# EAGLE design M1501X (EAGLE 6.6.0)
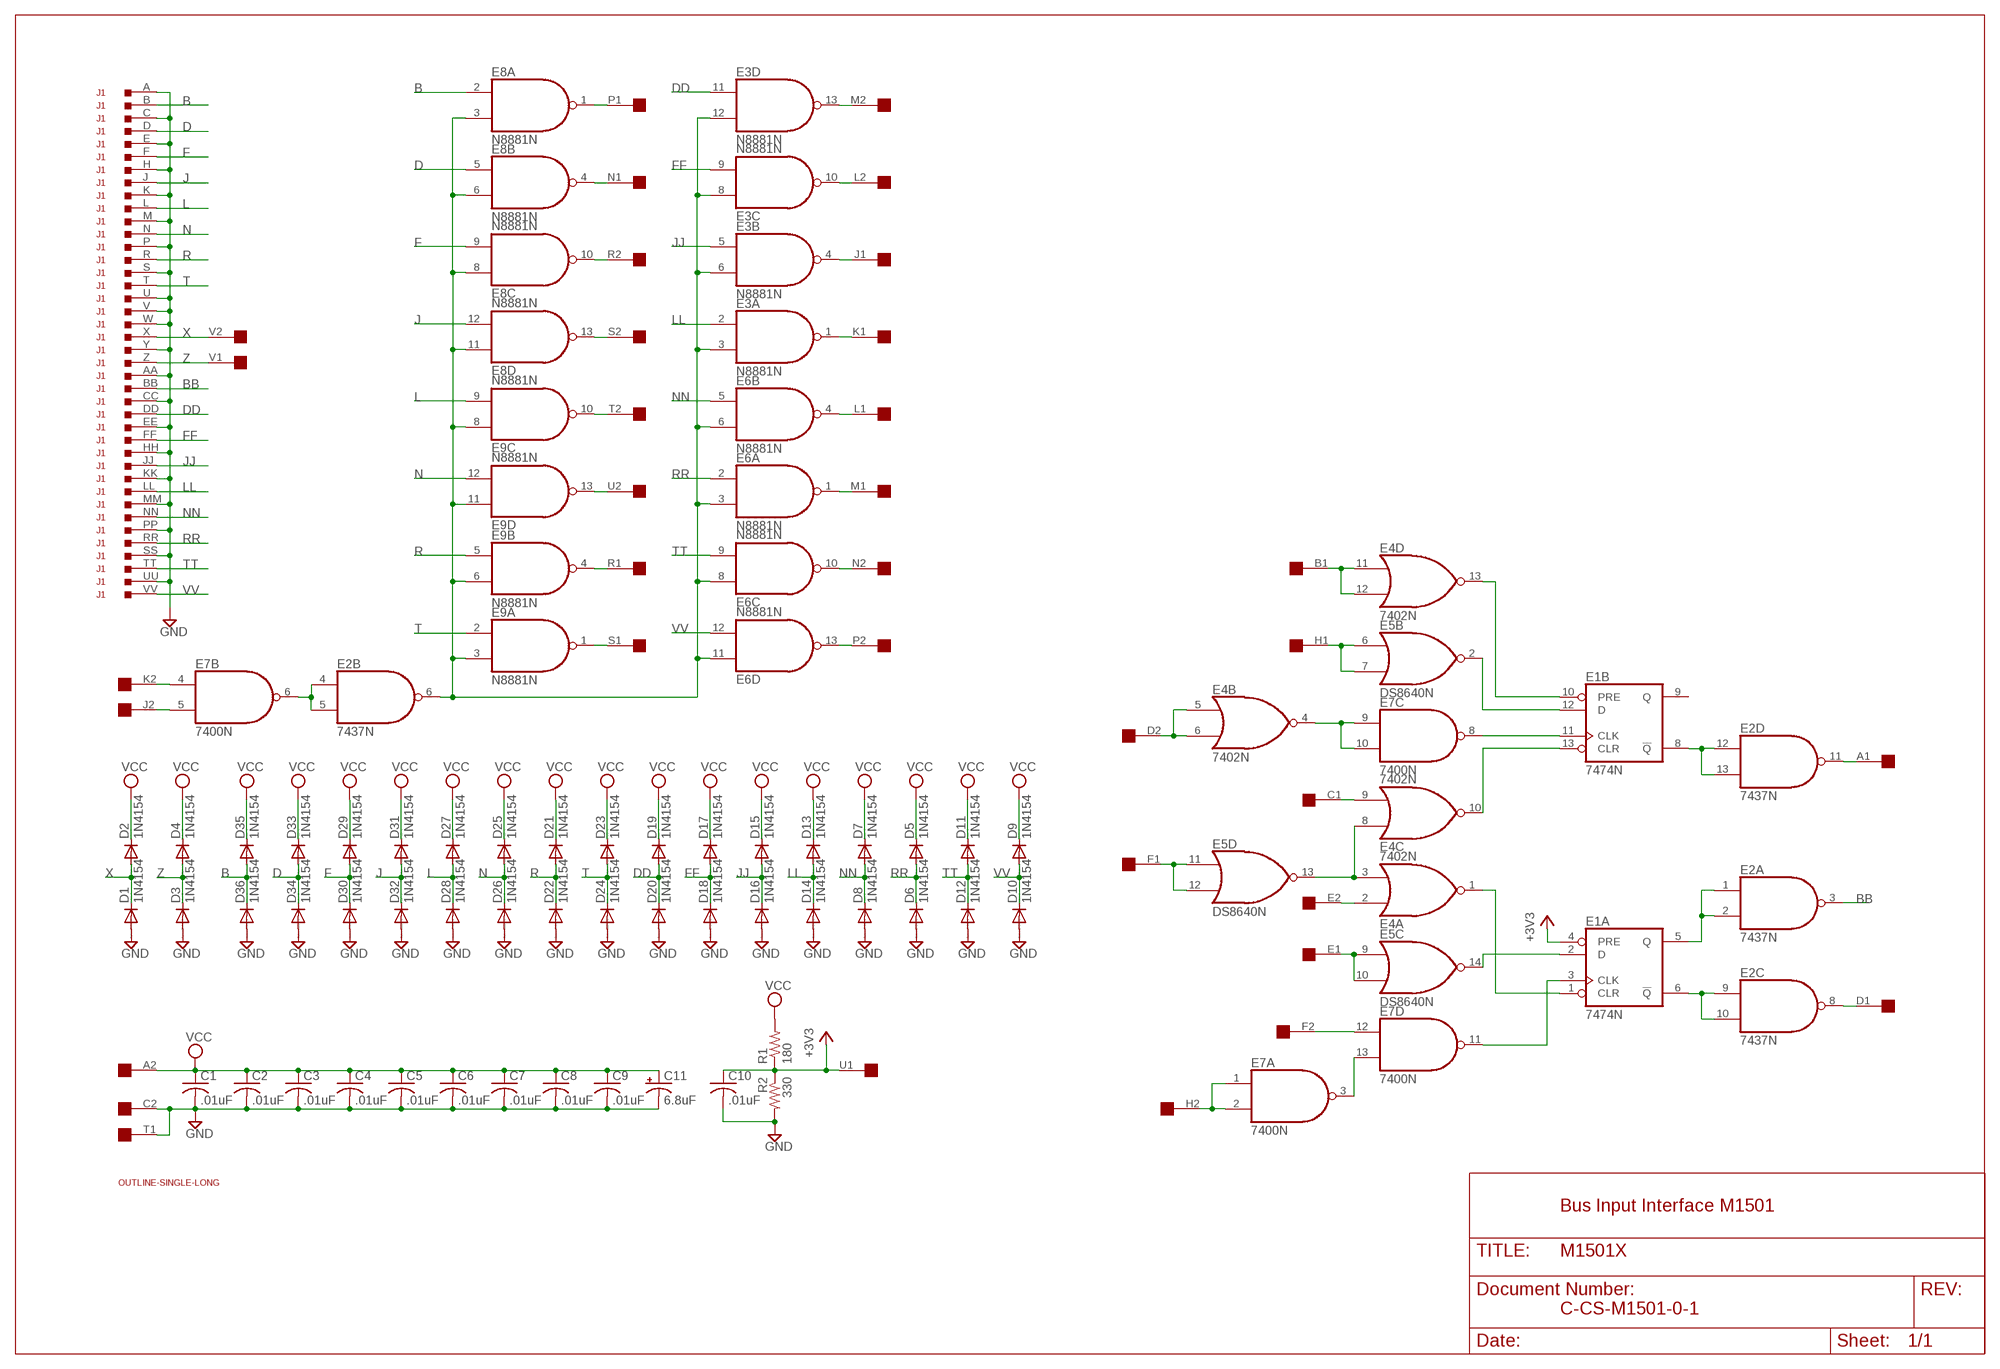
[diagram p0: schematic, sheet 1]

## Parts
C1  .01uF  C-US050-025X075  [C050-025X075]
C2  .01uF  C-US050-025X075  [C050-025X075]
C3  .01uF  C-US050-025X075  [C050-025X075]
C4  .01uF  C-US050-025X075  [C050-025X075]
C5  .01uF  C-US050-025X075  [C050-025X075]
C6  .01uF  C-US050-025X075  [C050-025X075]
C7  .01uF  C-US050-025X075  [C050-025X075]
C8  .01uF  C-US050-025X075  [C050-025X075]
C9  .01uF  C-US050-025X075  [C050-025X075]
C10  .01uF  C-US050-025X075  [C050-025X075]
C11  6.8uF  CPOL-USE20-8AXIAL  [E12-8]
D1  1N4154  DIODE-DO35-10  [DO35-10]
D2  1N4154  DIODE-DO35-10  [DO35-10]
D3  1N4154  DIODE-DO35-10  [DO35-10]
D4  1N4154  DIODE-DO35-10  [DO35-10]
D5  1N4154  DIODE-DO35-10  [DO35-10]
D6  1N4154  DIODE-DO35-10  [DO35-10]
D7  1N4154  DIODE-DO35-10  [DO35-10]
D8  1N4154  DIODE-DO35-10  [DO35-10]
D9  1N4154  DIODE-DO35-10  [DO35-10]
D10  1N4154  DIODE-DO35-10  [DO35-10]
D11  1N4154  DIODE-DO35-10  [DO35-10]
D12  1N4154  DIODE-DO35-10  [DO35-10]
D13  1N4154  DIODE-DO35-10  [DO35-10]
D14  1N4154  DIODE-DO35-10  [DO35-10]
D15  1N4154  DIODE-DO35-10  [DO35-10]
D16  1N4154  DIODE-DO35-10  [DO35-10]
D17  1N4154  DIODE-DO35-10  [DO35-10]
D18  1N4154  DIODE-DO35-10  [DO35-10]
D19  1N4154  DIODE-DO35-10  [DO35-10]
D20  1N4154  DIODE-DO35-10  [DO35-10]
D21  1N4154  DIODE-DO35-10  [DO35-10]
D22  1N4154  DIODE-DO35-10  [DO35-10]
D23  1N4154  DIODE-DO35-10  [DO35-10]
D24  1N4154  DIODE-DO35-10  [DO35-10]
D25  1N4154  DIODE-DO35-10  [DO35-10]
D26  1N4154  DIODE-DO35-10  [DO35-10]
D27  1N4154  DIODE-DO35-10  [DO35-10]
D28  1N4154  DIODE-DO35-10  [DO35-10]
D29  1N4154  DIODE-DO35-10  [DO35-10]
D30  1N4154  DIODE-DO35-10  [DO35-10]
D31  1N4154  DIODE-DO35-10  [DO35-10]
D32  1N4154  DIODE-DO35-10  [DO35-10]
D33  1N4154  DIODE-DO35-10  [DO35-10]
D34  1N4154  DIODE-DO35-10  [DO35-10]
D35  1N4154  DIODE-DO35-10  [DO35-10]
D36  1N4154  DIODE-DO35-10  [DO35-10]
E1  7474N  74S74N  [DIL14]
E2  7437N  [DIL14]
E3  N8881N  [DIL14]
E4  7402N  [DIL14]
E5  DS8640N  [DIL14]
E6  N8881N  [DIL14]
E7  7400N  [DIL14]
E8  N8881N  [DIL14]
E9  N8881N  [DIL14]
J1  DEC40PINSH  [DEC40PINH]
R1  180  R-US_0207/10  [0207/10]
R2  330  R-US_0207/10  [0207/10]
U$1  OUTLINE-SINGLE-LONG  [SINGLE-LONG]
U$2  SINGLE  [EDGE-CON2]

## Nets
+3V3 [supply]: C10.1 E1.4(A:PRE) R1.1 R2.1 U$2.U1
A1: E2.11(D:O) U$2.A1
B: D35.A D36.C E8.2(A:I0) J1.B
B1: E4.11(D:I0) E4.12(D:I1) U$2.B1
BB: E2.3(A:O) J1.BB
C1: E4.9(C:I1) U$2.C1
D: D33.A D34.C E8.5(B:I0) J1.D
D1: E2.8(C:O) U$2.D1
D2: E4.5(B:I0) E4.6(B:I1) U$2.D2
DD: D19.A D20.C E3.11(D:I0) J1.DD
E1: E5.9(C:I0) E5.10(C:I1) U$2.E1
E2: E4.2(A:I0) U$2.E2
F: D29.A D30.C E8.9(C:I1) J1.F
F1: E5.11(D:I0) E5.12(D:I1) U$2.F1
F2: E7.12(D:I0) U$2.F2
FF: D17.A D18.C E3.9(C:I1) J1.FF
GND [supply]: C1.2 C2.2 C3.2 C4.2 C5.2 C6.2 C7.2 C8.2 C9.2 C10.2 C11.- D1.A D3.A D6.A D8.A D10.A D12.A D14.A D16.A D18.A D20.A D22.A D24.A D26.A D28.A D30.A D32.A D34.A D36.A J1.A J1.AA J1.C J1.CC J1.E J1.EE J1.H J1.HH J1.K J1.KK J1.M J1.MM J1.P J1.PP J1.S J1.SS J1.U J1.UU J1.V J1.W J1.Y R2.2 U$2.C2 U$2.T1
H1: E5.6(B:I0) E5.7(B:I1) U$2.H1
H2: E7.1(A:I0) E7.2(A:I1) U$2.H2
J: D31.A D32.C E8.12(D:I1) J1.J
J1: E3.4(B:O) U$2.J1
J2: E7.5(B:I1) U$2.J2
JJ: D15.A D16.C E3.5(B:I0) J1.JJ
K1: E3.1(A:O) U$2.K1
K2: E7.4(B:I0) U$2.K2
L: D27.A D28.C E9.9(C:I1) J1.L
L1: E6.4(B:O) U$2.L1
L2: E3.10(C:O) U$2.L2
LL: D13.A D14.C E3.2(A:I0) J1.LL
M1: E6.1(A:O) U$2.M1
M2: E3.13(D:O) U$2.M2
N: D25.A D26.C E9.12(D:I1) J1.N
N1: E8.4(B:O) U$2.N1
N2: E6.10(C:O) U$2.N2
N$1: E2.4(B:I0) E2.5(B:I1) E7.6(B:O)
N$52: E1.11(B:CLK) E7.8(C:O)
N$55: E7.3(A:O) E7.13(D:I1)
N$57: E4.4(B:O) E7.9(C:I0) E7.10(C:I1)
N$69: E1.3(A:CLK) E7.11(D:O)
N$71: E1.5(A:Q) E2.1(A:I0) E2.2(A:I1)
N$73: E1.2(A:D) E5.14(C:O)
N$77: E1.12(B:D) E5.2(B:O)
N$80: E2.6(B:O) E3.3(A:I1) E3.6(B:I1) E3.8(C:I0) E3.12(D:I1) E6.3(A:I1) E6.6(B:I1) E6.8(C:I0) E6.11(D:I0) E8.3(A:I1) E8.6(B:I1) E8.8(C:I0) E8.11(D:I0) E9.3(A:I1) E9.6(B:I1) E9.8(C:I0) E9.11(D:I0)
N$154: E1.13(B:CLR) E4.10(C:O)
N$157: E1.10(B:PRE) E4.13(D:O)
N$158: E1.1(A:CLR) E4.1(A:O)
N$163: E1.6(A:!Q) E2.9(C:I0) E2.10(C:I1)
N$164: E1.8(B:!Q) E2.12(D:I0) E2.13(D:I1)
N$197: E4.3(A:I1) E4.8(C:I0) E5.13(D:O)
NN: D7.A D8.C E6.5(B:I0) J1.NN
P1: E8.1(A:O) U$2.P1
P2: E6.13(D:O) U$2.P2
R: D21.A D22.C E9.5(B:I0) J1.R
R1: E9.4(B:O) U$2.R1
R2: E8.10(C:O) U$2.R2
RR: D5.A D6.C E6.2(A:I0) J1.RR
S1: E9.1(A:O) U$2.S1
S2: E8.13(D:O) U$2.S2
T: D23.A D24.C E9.2(A:I0) J1.T
T2: E9.10(C:O) U$2.T2
TT: D11.A D12.C E6.9(C:I1) J1.TT
U2: E9.13(D:O) U$2.U2
VCC [supply]: C1.1 C2.1 C3.1 C4.1 C5.1 C6.1 C7.1 C8.1 C9.1 C11.+ D2.C D4.C D5.C D7.C D9.C D11.C D13.C D15.C D17.C D19.C D21.C D23.C D25.C D27.C D29.C D31.C D33.C D35.C R1.2 U$2.A2
VV: D9.A D10.C E6.12(D:I1) J1.VV
X: D1.C D2.A J1.X U$2.V2
Z: D3.C D4.A J1.Z U$2.V1
Unconnected: E1.9(B:Q) E5.3(A:O) E5.4(A:I0) E5.5(A:I1) U$2.B2

## Notes on the sheet
- Bus Input Interface M1501
- C-CS-M1501-0-1

## Power pins joined to a net without a drawn wire
GND: E1.7(P:GND) E2.7(P:GND) E3.7(P:GND) E4.7(P:GND) E5.1(P:GND) E6.7(P:GND) E7.7(P:GND) E8.7(P:GND) E9.7(P:GND)
VCC: E1.14(P:VCC) E2.14(P:VCC) E3.14(P:VCC) E4.14(P:VCC) E5.8(P:VCC) E6.14(P:VCC) E7.14(P:VCC) E8.14(P:VCC) E9.14(P:VCC)

## Library data of the parts
C1-C10 = rcl:C-US: CAPACITOR, American symbol
C11 = dec-con:CPOL-USE20-8AXIAL: A 0.8 inch electrolytic.
D1-D36 = diode:DIODE-: DIODE
E1 = 74xx-us:74*74: Dual D type positive edge triggered FLIP FLOP, preset and clear
E2 = 74xx-us:74*37: Quad 2-input NAND buffer
E3 E6 E8 E9 = dec-con:N8881: Quad 2-input NAND gate, open collector
E4 = 74xx-us:74*02: Quad 2-input NOR gate
E5 = dec-con:DS8640: Quad NOR gate
E7 = 74xx-us:74*00: Quad 2-input NAND gate
J1 = dec-con:DEC40PINS: 40 pin ribbon connector for BC08, BC11 cables.
R1 R2 = rcl:R-US_: RESISTOR, American symbol
U$1 = dec-con:OUTLINE-*: Board outlines for DEC boards.
U$2 = dec-con:SINGLE: Single-Height DEC board

## Net classes
1 supply: width 0.813 mm

## Board
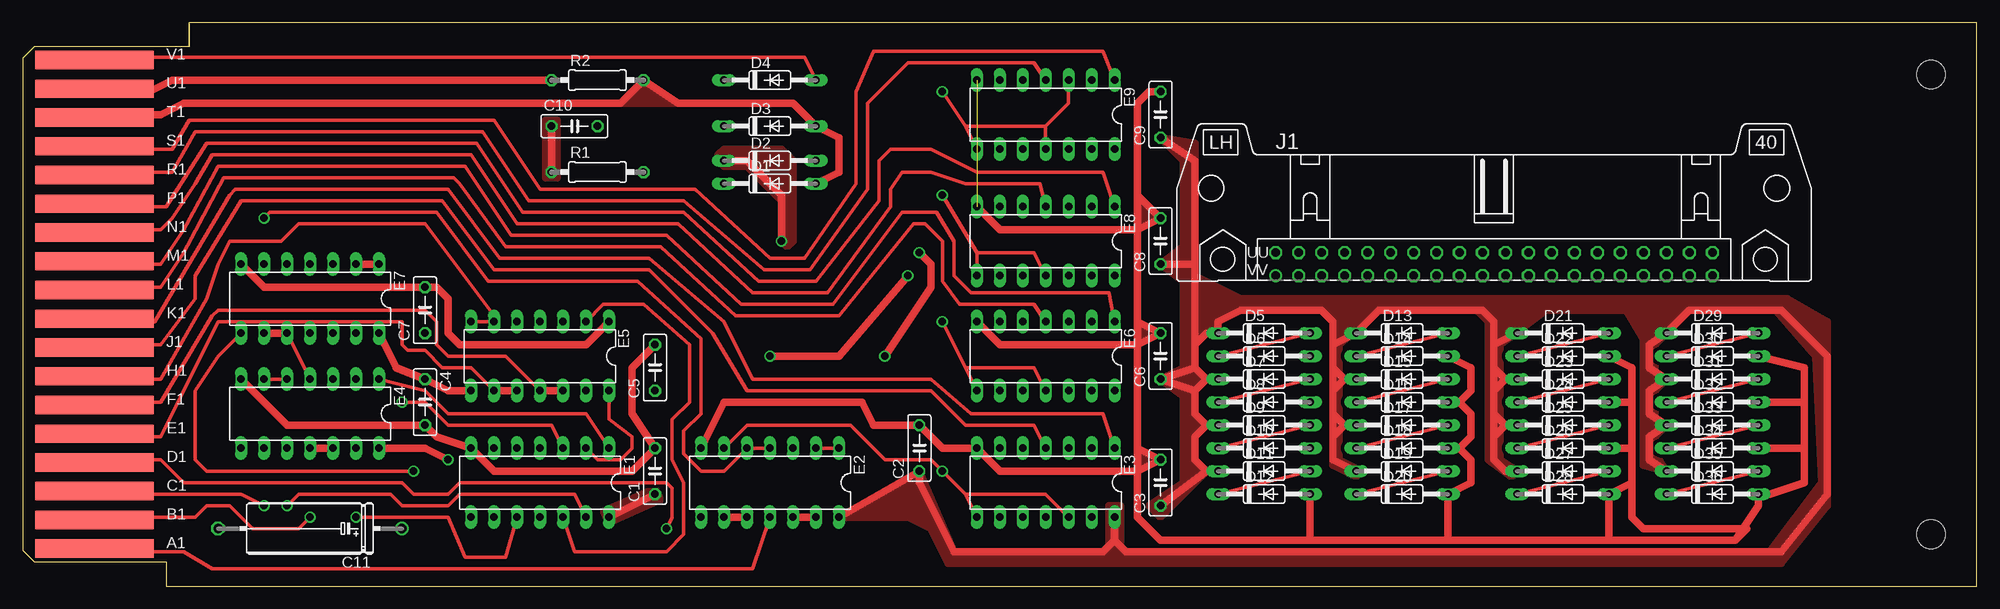
[diagram p1: board, top side]
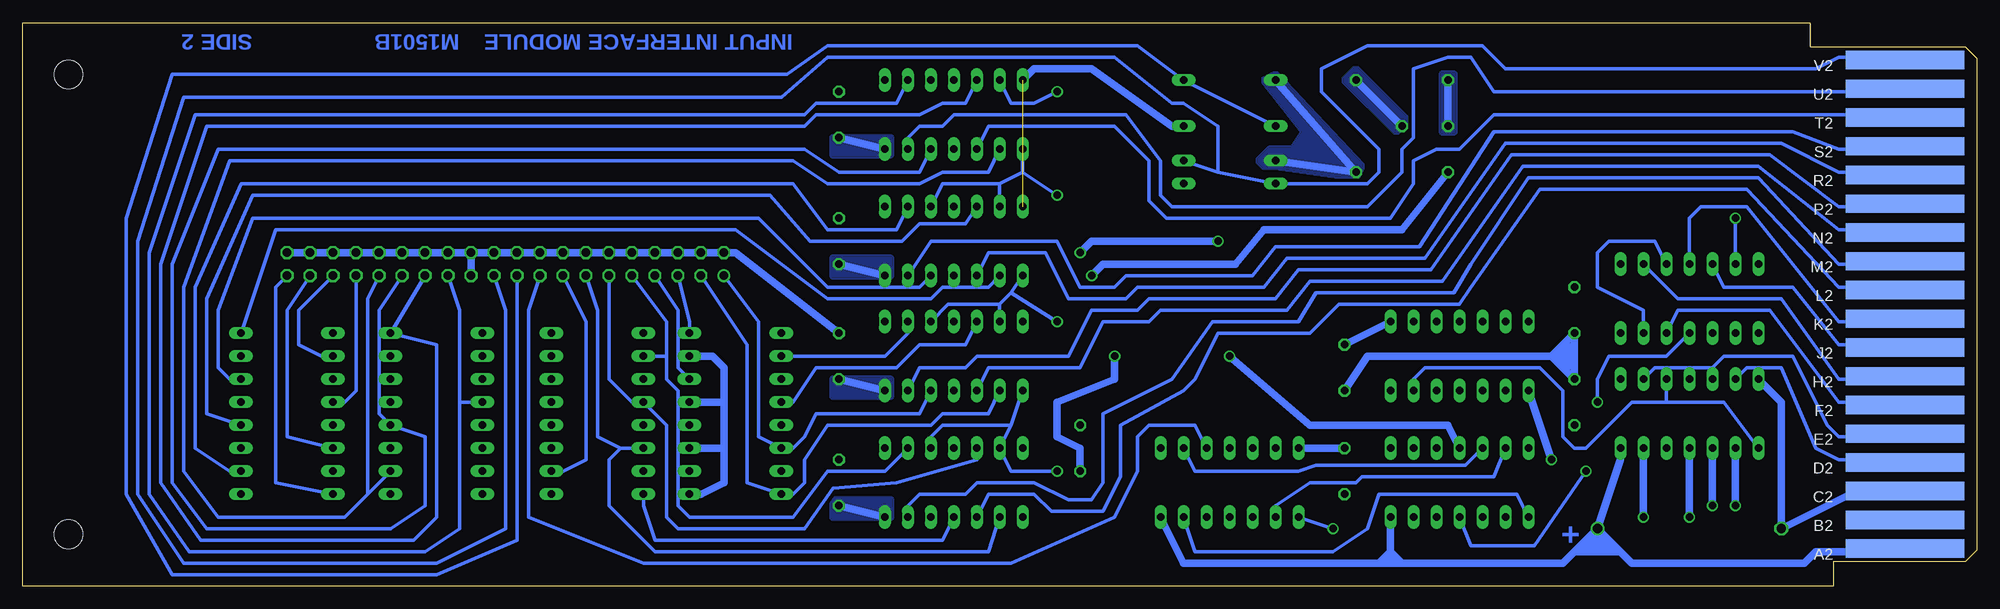
[diagram p2: board, bottom side, seen from below]

Size 215.9 x 62.23 mm. Coordinates in mm from the lower left corner, seen from the top.
Copper layers (1+16): Top 0.035mm / dielectric 1.5mm / Bottom 0.035mm
Design rules "16mils": minimum track width 16mil, minimum drill 32mil, track to track 15mil, track to pad 10mil, pad to pad 10mil, via to via 10mil, smd to smd 10mil, copper to edge 13mil, drill to drill 10mil, minimum pad ring 10mil, minimum via ring 8mil, stop-mask expansion 0mil, vias tented up to drill 0mil, thermal gap 10mil

### Footprints (pad centres in the part's own frame; a part is rotated, then mirrored left to right if it is on the bottom)
C050-025X075 = drill 0.813 octagon: 1 -2.54,0; 2 2.54,0
E12-8 = drill 1.016: + -10.16,0 | drill 1.016 octagon: - 10.16,0
DO35-10 = drill 0.813 long: A 5.08,0; C -5.08,0
DIL14 = drill 0.813 long: 1 -7.62,-3.81; 2 -5.08,-3.81; 3 -2.54,-3.81; 4 0,-3.81; 5 2.54,-3.81; 6 5.08,-3.81; 7 7.62,-3.81; 8 7.62,3.81; 9 5.08,3.81; 10 2.54,3.81; 11 0,3.81; 12 -2.54,3.81; 13 -5.08,3.81; 14 -7.62,3.81
DEC40PINH = drill 0.914 octagon: A 24.13,1.27; AA -3.81,1.27; B 24.13,-1.27; BB -3.81,-1.27; C 21.59,1.27; CC -6.35,1.27; D 21.59,-1.27; DD -6.35,-1.27; E 19.05,1.27; EE -8.89,1.27; F 19.05,-1.27; FF -8.89,-1.27; H 16.51,1.27; HH -11.43,1.27; J 16.51,-1.27; JJ -11.43,-1.27; K 13.97,1.27; KK -13.97,1.27; L 13.97,-1.27; LL -13.97,-1.27; M 11.43,1.27; MM -16.51,1.27; N 11.43,-1.27; NN -16.51,-1.27; P 8.89,1.27; PP -19.05,1.27; R 8.89,-1.27; RR -19.05,-1.27; S 6.35,1.27; SS -21.59,1.27; T 6.35,-1.27; TT -21.59,-1.27; U 3.81,1.27; UU -24.13,1.27; V 3.81,-1.27; W 1.27,1.27; X 1.27,-1.27; Y -1.27,1.27; Z -1.27,-1.27 | drill 0.914: VV -24.13,-1.27
0207/10 = drill 0.813 octagon: 1 -5.08,0; 2 5.08,0
SINGLE-LONG = hole 3.175: 210.82,56.515; 210.82,5.715
EDGE-CON2 = smd 13.106 x 2.032: A1 7.938,4.128; B1 7.938,7.303; C1 7.938,10.477; D1 7.938,13.652; E1 7.938,16.828; F1 7.938,20.003; H1 7.938,23.177; J1 7.938,26.352; K1 7.938,29.527; L1 7.938,32.703; M1 7.938,35.877; N1 7.938,39.053; P1 7.938,42.227; R1 7.938,45.403; S1 7.938,48.578; T1 7.938,51.752; U1 7.938,54.928; V1 7.938,58.102 | smd 13.106 x 2.032 bottom: A2 7.938,4.128; B2 7.938,7.303; C2 7.938,10.477; D2 7.938,13.652; E2 7.938,16.828; F2 7.938,20.003; H2 7.938,23.177; J2 7.938,26.352; K2 7.938,29.527; L2 7.938,32.703; M2 7.938,35.877; N2 7.938,39.053; P2 7.938,42.227; R2 7.938,45.403; S2 7.938,48.578; T2 7.938,51.752; U2 7.938,54.928; V2 7.938,58.102

### Placement (x,y rotation side)
C1  69.85,12.7 90 top
C2  99.06,15.24 90 top
C3  125.73,11.43 90 top
C4  44.45,20.32 270 top
C5  69.85,24.13 90 top
C6  125.73,25.4 90 top
C7  44.45,30.48 90 top
C8  125.73,38.1 90 top
C9  125.73,52.07 90 top
C10  60.96,50.8 0 top
C11  31.75,6.35 180 top
D1  82.55,44.45 0 top
D2  82.55,46.99 0 top
D3  82.55,50.8 0 top
D4  82.55,55.88 0 top
D5  137.16,27.94 0 top
D6  137.16,25.4 0 top
D7  137.16,22.86 0 top
D8  137.16,20.32 0 top
D9  137.16,17.78 0 top
D10  137.16,15.24 0 top
D11  137.16,12.7 0 top
D12  137.16,10.16 0 top
D13  152.4,27.94 0 top
D14  152.4,25.4 0 top
D15  152.4,22.86 0 top
D16  152.4,20.32 0 top
D17  152.4,17.78 0 top
D18  152.4,15.24 0 top
D19  152.4,12.7 0 top
D20  152.4,10.16 0 top
D21  170.18,27.94 0 top
D22  170.18,25.4 0 top
D23  170.18,22.86 0 top
D24  170.18,20.32 0 top
D25  170.18,17.78 0 top
D26  170.18,15.24 0 top
D27  170.18,12.7 0 top
D28  170.18,10.16 0 top
D29  186.69,27.94 0 top
D30  186.69,25.4 0 top
D31  186.69,22.86 0 top
D32  186.69,20.32 0 top
D33  186.69,17.78 0 top
D34  186.69,15.24 0 top
D35  186.69,12.7 0 top
D36  186.69,10.16 0 top
E1  57.15,11.43 180 top
E2  82.55,11.43 180 top
E3  113.03,11.43 180 top
E4  31.75,19.05 180 top
E5  57.15,25.4 180 top
E6  113.03,25.4 180 top
E7  31.75,31.75 180 top
E8  113.03,38.1 180 top
E9  113.03,52.07 180 top
J1  162.56,35.56 0 top
R1  63.5,45.72 0 top
R2  63.5,55.88 0 top
U$1  0,0 0 top
U$2  0,0 0 top

### Tracks (layer width: path | path; a pad name or v marks a point on that pad's centre or on a via)
+3V3  (via drill 0.81)
  Top 0.813: R2.1 16.51,55.88 13.97,54.61 8.89,54.61 U$2.U1 | v82.55,25.4 90.17,25.4 v97.79,34.29 | R1.1 C10.1
  Bottom 0.813: C10.1 R2.1 | v97.79,34.29 96.52,35.56 81.92,35.56 78.74,39.37 63.5,39.37 R1.1 | E1.4 58.42,17.78 73.66,17.78 v82.55,25.4
  pour Bottom (no thermals): 57.79,56.52 59.06,56.52 59.06,50.16 57.79,50.16
  pour Top (no thermals): 57.79,45.09 57.79,51.44 59.06,51.44 59.06,45.09
A1
  Top 0.406: U$2.A1 8.89,3.81 17.78,3.81 20.96,1.91 80.65,1.91 E2.11
B
  Top 0.406: D36.C D35.A
  Bottom 0.406: D35.A 193.04,12.7 196.85,15.24 196.85,33.02 191.77,44.45 130.81,44.45 127,39.37 119.38,39.37 E8.2 | J1.B 187.96,33.02 187.96,11.43 D36.C
B1  (via drill 0.81)
  Top 0.406: U$2.B1 8.89,7.62 19.05,7.62 20.32,8.89 22.86,8.89 25.4,6.35 30.48,6.35 v31.75,7.62
  Top 0.813: E4.12 E4.11
  Bottom 0.813: E4.11 v31.75,7.62
BB
  Bottom 0.406: E2.3 86.36,17.78 91.44,17.78 92.71,16.51 92.71,12.7 95.25,7.62 106.68,2.54 147.32,2.54 160.02,7.62 160.02,30.48 J1.BB
C1  (via drill 0.81)
  Top 0.406: U$2.C1 10.16,10.16 24.13,10.16 v26.67,8.89
  Bottom 0.813: E4.9 v26.67,8.89
D
  Top 0.406: D33.A D34.C
  Bottom 0.406: E8.5 111.76,40.01 116.84,40.01 118.75,38.1 128.91,38.1 133.35,43.18 190.5,43.18 195.58,31.75 195.58,19.05 D33.A | D34.C 186.69,16.51 186.69,30.48 J1.D
D1  (via drill 0.81)
  Top 0.406: U$2.D1 8.89,13.97 15.24,13.97 17.78,11.43 41.91,11.43 43.18,10.16 46.99,10.16 48.26,11.43 71.12,11.43 71.76,10.79 71.76,7.62 v71.12,6.35
  Bottom 0.406: E2.8 v71.12,6.35
D2
  Top 0.406: E4.5 E4.6
  Bottom 0.406: E4.6 25.4,24.13 21.59,24.13 17.78,15.24 15.24,13.97 8.89,13.97 U$2.D2
DD
  Top 0.406: D19.A D20.C
  Bottom 0.406: E3.11 114.3,5.08 146.05,5.08 147.32,8.89 D20.C | D19.A 156.21,12.7 153.67,13.97 153.67,29.21 J1.DD
E1
  Top 0.406: U$2.E1 8.89,16.51 15.24,16.51 21.59,29.21 41.91,29.21 41.91,26.67 42.55,26.04 44.45,26.04 46.36,24.13 49.53,24.13 E5.9
  Top 0.813: E5.9 E5.10
E2
  Bottom 0.406: E4.2 35.56,24.13 29.21,24.13 27.94,25.4 20.32,25.4 16.51,17.78 15.24,16.51 8.89,16.51 U$2.E2
F
  Top 0.406: D29.A D30.C
  Bottom 0.406: D29.A 187.96,39.37 137.16,39.37 127,31.75 115.57,31.75 114.3,33.02 109.22,33.02 E8.9 | J1.F 185.42,30.48 185.42,26.67 182.88,25.4 D30.C
F1
  Top 0.406: U$2.F1 8.89,20.32 15.24,20.32 20.96,29.84 21.59,30.48 44.45,30.48 45.72,29.21 45.72,26.67 46.99,25.4 53.34,25.4 E5.11
  Top 0.813: E5.11 E5.12
F2
  Bottom 0.406: E7.12 33.02,30.48 22.86,30.48 15.24,20.32 8.89,20.32 U$2.F2
FF
  Top 0.406: D18.C D17.A
  Bottom 0.406: 149.86,15.24 152.4,16.51 152.4,30.48 J1.FF | D18.C 149.86,15.24 | 149.86,15.24 151.13,13.97 151.13,8.89 146.05,3.81 109.22,3.81 E3.9
GND  (1 unrouted)
  Top 0.813: D12.A 142.24,5.08 | 142.24,5.08 157.48,5.08 | 157.48,5.08 D20.A 160.02,11.43 160.02,13.97 158.75,15.24 | 157.48,5.08 175.26,5.08 | 175.26,5.08 D28.A 177.8,11.43 | 175.26,5.08 189.23,5.08 | 189.23,5.08 191.77,8.89 D36.A 193.04,10.16 196.85,11.43 196.85,15.24 | D34.A 196.85,15.24 | D32.A 196.85,20.32 | 196.85,20.32 196.85,15.24 | D30.A 196.85,24.13 196.85,20.32 | D22.A 177.8,24.13 177.8,20.32 | 177.8,20.32 177.8,15.24 | 177.8,15.24 177.8,11.43 | 177.8,11.43 177.8,7.62 179.07,6.35 190.5,6.35 189.23,5.08 | D24.A 177.8,20.32 | D26.A 177.8,15.24 | D18.A 158.75,15.24 | 158.75,15.24 160.02,16.51 160.02,19.05 158.75,20.32 | D16.A 158.75,20.32 | 158.75,20.32 160.02,21.59 160.02,24.13 D14.A | 142.24,5.08 125.73,5.08 123.19,7.62 123.19,12.7 | 123.19,12.7 123.19,15.24 | 123.19,15.24 123.19,26.67 | 123.19,26.67 123.19,29.21 | 123.19,29.21 123.19,39.37 | 123.19,39.37 123.19,43.18 | 123.19,43.18 123.19,53.34 124.46,54.61 C9.2 | 123.19,43.18 C8.2 123.19,39.37 | 123.19,26.67 C6.2 123.19,29.21 | 123.19,12.7 C3.2 123.19,15.24 | U$2.T1 8.89,52.07 15.24,52.07 17.78,53.34 66.04,53.34 R2.2 72.39,53.34 85.09,53.34 D3.A 90.17,49.53 90.17,45.72 D1.A | E2.7 77.47,20.32 92.71,20.32 93.98,17.78 C2.2 101.6,15.24 E3.7 107.95,12.7 123.19,12.7 | C5.2 67.31,24.13 67.31,19.05 C1.2 67.31,12.7 52.07,12.7 E1.7 45.72,16.51 C4.2 29.21,17.78 E4.7 | E6.7 107.95,26.67 123.19,26.67 | E8.7 107.95,39.37 123.19,39.37 | E7.7 26.67,33.02 C7.2 45.72,33.02 46.99,31.75 46.99,27.94 48.26,26.67 62.23,26.67 E5.1
  Bottom 0.813: C6.2 137.16,36.83 J1.UU J1.SS J1.PP J1.MM J1.KK J1.HH J1.EE J1.CC J1.AA J1.Y J1.W J1.U | J1.A J1.C J1.E J1.H J1.K J1.M J1.P J1.S J1.U | J1.V J1.U | C1.2 E2.7 | E4.7 21.59,20.32 C11.- 13.97,10.16 8.89,10.16 U$2.C2 | E5.1 C5.2 | E9.7 104.14,57.15 97.79,57.15 88.9,50.8 D3.A | D12.A 140.97,10.16 138.43,11.43 138.43,15.24 | 138.43,15.24 138.43,20.32 | 138.43,20.32 138.43,24.13 139.7,25.4 D6.A | D8.A 138.43,20.32 | D10.A 138.43,15.24 | C10.2 R2.2
  pour Top (no thermals): 68.58,55.88 66.04,53.34 72.39,53.34
  pour Bottom (no thermals): 63.5,52.07 62.87,51.44 64.14,50.16 69.85,55.88 68.58,57.15
  pour Top (no thermals): 123.19,15.24 125.73,13.97 123.19,12.7
  pour Top (no thermals): 123.19,26.67 125.73,27.94 123.19,29.21
  pour Top (no thermals): 123.19,39.37 125.73,40.64 123.19,43.18
H1
  Top 0.406: U$2.H1 10.16,22.86 15.24,22.86 20.32,31.75 21.59,35.56 22.86,38.1 28.58,38.1 30.48,40.01 44.45,40.01 52.07,29.84 E5.6 E5.7
H2
  Top 0.813: E7.2 E7.1
  Bottom 0.406: E7.2 33.02,31.75 21.59,31.75 15.24,22.86 8.89,22.86 U$2.H2
J
  Top 0.406: D32.C D31.A
  Bottom 0.406: D31.A 193.04,22.86 194.31,24.13 194.31,30.48 190.5,40.64 134.62,40.64 127,33.02 116.84,33.02 E8.12 | D32.C 180.34,20.32 179.07,21.59 J1.J
J1
  Top 0.406: E3.4 111.76,17.78 104.14,17.78 100.33,21.59 80.01,21.59 76.2,27.94 69.22,34.92 52.07,34.92 46.36,42.55 24.13,42.55 19.05,34.29 19.05,31.75 15.24,26.67 8.89,26.67 U$2.J1
J2
  Bottom 0.406: E7.5 27.94,33.02 20.32,33.02 15.24,26.67 8.89,26.67 U$2.J2
JJ
  Top 0.406: D15.A D16.C
  Bottom 0.406: J1.JJ 151.13,22.86 148.59,20.32 D16.C 144.78,17.78 144.78,7.62 143.51,6.35 129.54,6.35 126.37,10.79 119.38,11.43 110.49,13.97 E3.5
K1
  Top 0.406: E3.1 119.38,19.05 104.78,19.05 100.33,22.86 80.65,22.86 77.47,29.21 69.22,36.2 52.71,36.2 46.99,43.81 23.5,43.81 22.86,43.18 14.61,29.21 8.89,29.21 U$2.K1
K2
  Bottom 0.406: E7.4 31.75,40.64 30.48,41.91 25.4,41.91 15.24,29.21 8.89,29.21 U$2.K2
L
  Top 0.406: D27.A D28.C
  Bottom 0.406: D27.A 177.8,10.16 | 177.8,10.16 180.34,7.62 194.31,7.62 198.12,12.7 198.12,33.02 193.04,46.99 130.81,46.99 127,44.45 116.84,44.45 114.3,45.72 109.22,45.72 E9.9 | J1.L 177.8,31.75 177.8,10.16
L1
  Top 0.406: U$2.L1 8.89,33.02 15.24,33.02 17.78,36.83 22.23,45.09 47.63,45.09 48.26,44.45 53.34,37.47 70.49,37.47 78.74,29.84 90.17,29.84 98.43,40.01 99.7,40.01 101.6,38.1 101.6,33.66 103.51,31.11 111.76,31.11 E6.4
L2
  Bottom 0.406: E3.10 109.22,10.16 104.14,10.16 102.24,8.26 96.52,8.26 94.62,12.06 94.62,17.78 87.63,21.59 86.36,22.86 83.82,27.94 73.66,27.94 70.49,31.11 57.15,31.11 55.88,33.02 48.26,43.81 25.4,43.81 15.24,33.02 8.89,33.02 U$2.L2
LL
  Top 0.406: D14.C D13.A
  Bottom 0.406: E3.2 120.65,12.7 127,12.7 130.81,7.62 142.24,7.62 143.51,8.89 143.51,21.59 144.78,22.86 144.78,25.4 | 144.78,25.4 144.78,29.21 J1.LL | D14.C 144.78,25.4
M1
  Top 0.406: U$2.M1 8.89,35.56 15.24,35.56 17.78,39.37 21.59,46.35 48.9,46.35 53.98,38.73 71.12,38.73 79.38,31.11 89.54,31.11 97.16,41.27 100.97,41.27 102.87,38.1 102.87,34.29 104.78,32.38 120.02,32.38 E6.1
M2
  Bottom 0.406: E3.13 118.11,8.89 116.84,10.16 111.76,10.16 110.49,11.43 104.14,11.43 100.33,9.53 97.79,9.53 96.52,11.43 96.52,19.05 88.9,22.86 84.46,29.21 74.93,29.21 73.03,32.38 57.79,32.38 55.88,35.56 49.53,45.09 24.13,45.09 15.24,35.56 8.89,35.56 U$2.M2
N
  Top 0.406: D26.C D25.A
  Bottom 0.406: J1.N 176.53,30.48 176.53,19.05 D25.A 171.45,16.51 171.45,8.89 175.26,6.35 195.58,6.35 199.39,11.43 199.39,35.56 194.31,48.26 129.54,48.26 125.73,45.72 116.84,45.72 E9.12
N1
  Top 0.406: U$2.N1 8.89,39.37 15.24,39.37 16.51,40.64 19.05,44.45 20.96,47.62 49.53,47.62 54.61,40.01 72.39,40.01 80.65,32.38 88.9,32.38 95.89,41.91 95.89,43.81 97.16,45.72 100.33,45.72 104.14,44.45 112.4,44.45 E8.4
N2
  Bottom 0.406: E6.10 109.22,24.13 99.06,24.13 96.52,29.21 91.44,29.21 90.17,30.48 76.2,30.48 73.66,33.66 59.06,33.66 50.17,46.35 24.13,46.35 15.24,39.37 8.89,39.37 U$2.N2
N$1  (via drill 0.81)
  Top 0.406: v26.67,40.64 27.31,41.27 45.72,41.27 51.44,33.66 67.95,33.66 74.93,27.3 74.93,19.05 73.03,17.14 73.03,14.61 74.93,12.7 77.47,12.7 E2.5 E2.4
  Bottom 0.406: E7.6 v26.67,40.64
N$52  (via drill 0.81)
  Top 0.406: v43.18,12.7 20.32,12.7 19.05,13.97 19.05,21.59 21.59,25.4 E7.8
  Bottom 0.406: E1.11 55.88,4.45 48.9,4.45 v43.18,12.7
N$55
  Bottom 0.406: E7.3 35.56,38.1 40.64,38.1 41.91,36.83 41.91,33.02 36.83,30.48 E7.13
N$57
  Top 0.406: E4.4 E7.10
  Top 0.813: E7.9 E7.10
N$69  (via drill 0.81)
  Top 0.406: E1.3 58.42,17.78 46.99,17.78 44.45,20.32 v41.91,20.32
  Bottom 0.406: E7.11 34.29,25.4 40.64,25.4 41.91,22.86 v41.91,20.32
N$71
  Top 0.406: E2.1 E2.2
  Bottom 0.406: E1.5 56.52,13.34 73.03,13.34 74.93,12.7 86.36,12.7 E2.2
N$73
  Top 0.406: E5.14 64.77,18.41 67.31,16.51 67.31,15.24 66.04,13.97 63.5,13.97 E1.2
N$77
  Top 0.406: E1.12 60.96,3.81 71.12,3.81 73.03,5.71 73.03,11.43 71.76,13.97 71.76,18.41 73.66,20.32 73.66,26.67 68.58,31.11 64.14,31.11 E5.2
N$80  (via drill 0.81)
  Top 0.406: v101.6,29.21 104.14,24.13 | 104.14,24.13 E6.8 | 104.14,10.16 v101.6,12.7 100.33,13.97 95.25,13.97 91.44,17.78 80.01,17.78 E2.6 | E3.8 104.14,10.16 | 104.14,10.16 113.03,10.16 E3.12 | 104.14,24.13 111.76,24.13 E6.11 | v101.6,43.18 105.41,36.83 | 105.41,36.83 E8.8 | 105.41,36.83 111.76,36.83 E8.11 | v101.6,54.61 104.14,50.8 | 104.14,50.8 E9.8 | 104.14,50.8 113.03,50.8 | 113.03,50.8 E9.11 | 113.03,50.8 115.57,53.34 E9.3
  Bottom 0.406: E6.3 113.67,31.11 107.95,31.11 | E6.6 107.95,31.11 | 107.95,31.11 106.68,32.38 | 106.68,32.38 E8.8 | v101.6,29.21 106.68,32.38 | E6.8 106.68,17.78 | 106.68,17.78 114.3,17.78 115.57,16.51 E3.3 | v101.6,12.7 106.68,12.7 E3.6 106.68,17.78 | E8.6 107.95,44.45 | 107.95,44.45 114.3,44.45 E8.3 | E9.8 105.41,45.72 | 105.41,45.72 107.95,44.45 | 105.41,45.72 v101.6,43.18 | E9.6 106.68,53.34 104.14,53.34 v101.6,54.61
N$154  (via drill 0.81)
  Top 0.406: v29.21,8.89 30.48,10.16 40.64,10.16 41.91,8.89 46.99,8.89 48.26,10.16 60.96,10.16 E1.13
  Bottom 0.813: E4.10 v29.21,8.89
N$157  (via drill 0.81)
  Top 0.406: v36.83,7.62 46.99,7.62 48.9,3.17 53.34,3.17 E1.10
  Bottom 0.813: E4.13 v36.83,7.62
N$158
  Top 0.406: E1.1 62.23,19.05 46.99,19.05 44.45,21.59 E4.1
N$163
  Top 0.813: E2.9 E2.10
  Bottom 0.406: E2.9 77.47,8.89 73.66,11.43 68.58,11.43 67.95,12.06 53.34,12.06 E1.6
N$164
  Top 0.813: E2.12 E2.13
  Bottom 0.406: E1.8 50.8,10.16 66.04,10.16 67.31,6.35 71.12,3.81 86.36,3.81 E2.13
N$197
  Bottom 0.406: E4.8 27.94,20.32 34.29,20.32 | 34.29,20.32 E4.3 | 34.29,20.32 38.1,20.32 43.18,15.24 44.45,15.24 45.72,16.51 45.72,21.59 48.26,24.13 60.96,24.13 62.23,22.86 E5.13
NN
  Top 0.406: D7.A D8.C
  Bottom 0.406: J1.NN 143.51,30.48 143.51,24.13 D7.A | D8.C 130.81,20.32 128.27,24.13 119.38,24.13 116.84,26.67 111.76,26.67 E6.5
P1
  Top 0.406: E8.1 119.38,45.72 105.41,45.72 100.33,48.26 95.89,48.26 94.62,46.99 94.62,42.55 87.63,33.66 81.28,33.66 73.03,41.27 55.25,41.27 50.17,48.9 20.32,48.9 15.88,41.91 10.16,41.91 U$2.P1
P2
  Bottom 0.406: E6.13 116.84,24.13 111.76,24.13 110.49,25.4 100.33,25.4 97.79,30.48 92.71,30.48 91.44,31.75 77.47,31.75 74.93,34.92 60.33,34.92 51.44,47.62 22.86,47.62 15.24,41.91 8.89,41.91 U$2.P2
R
  Top 0.406: D22.C D21.A
  Bottom 0.406: J1.R D21.A 170.18,26.67 170.18,7.62 172.72,5.08 196.22,5.08 200.66,11.43 200.66,35.56 195.58,50.8 129.54,50.8 128.27,52.07 116.84,52.07 114.3,53.34 111.76,53.34 E9.5
R1
  Top 0.406: E9.4 111.76,57.78 97.79,57.78 93.35,53.34 93.35,43.81 87,34.92 81.92,34.92 73.03,42.55 55.88,42.55 50.8,50.16 19.05,50.16 16.51,45.72 10.16,45.72 U$2.R1
R2
  Bottom 0.406: E8.10 109.22,36.83 102.87,36.83 100.33,31.75 93.98,31.75 92.71,33.02 78.74,33.02 76.2,36.2 60.96,36.2 52.07,48.9 21.59,48.9 15.24,45.72 8.89,45.72 U$2.R2
RR
  Top 0.406: D5.A D6.C
  Bottom 0.406: J1.RR 142.24,29.21 D5.A | E6.2 118.11,27.94 120.65,25.4 D6.C
S1
  Top 0.406: U$2.S1 8.89,48.26 16.51,48.26 18.42,51.44 52.07,51.44 57.15,43.81 74.3,43.81 82.55,36.2 86.36,36.2 92.08,44.45 92.08,54.61 93.98,59.05 119.38,59.05 E9.1
S2
  Bottom 0.406: E8.13 115.57,38.1 101.6,38.1 99.06,33.02 95.25,33.02 93.98,34.29 80.01,34.29 77.47,37.47 61.6,37.47 53.34,50.16 20.32,50.16 15.24,48.26 8.89,48.26 U$2.S2
T
  Top 0.406: D23.A D24.C
  Bottom 0.406: J1.T 167.64,30.48 167.64,20.32 | 167.64,20.32 167.64,6.35 171.45,3.81 197.49,3.81 201.93,10.16 201.93,36.83 196.85,52.07 129.54,52.07 128.27,53.34 119.38,53.34 E9.2 | D24.C 167.64,20.32
T2
  Bottom 0.406: E9.10 109.22,50.8 95.25,50.8 91.44,46.99 91.44,42.55 89.54,40.64 64.77,40.64 62.23,44.45 62.23,46.99 59.69,48.26 57.15,48.26 53.34,52.07 8.89,52.07 U$2.T2
TT
  Top 0.406: D11.A D12.C
  Bottom 0.406: J1.TT 135.89,26.67 135.89,11.43 D12.C 130.81,10.16 129.54,11.43 129.54,13.97 127,17.78 115.57,17.78 114.3,19.05 109.22,19.05 E6.9
U2
  Bottom 0.406: E9.13 118.11,49.53 116.84,50.8 114.3,50.8 113.03,52.07 93.98,52.07 90.17,46.99 90.17,43.18 88.9,41.91 67.31,41.91 63.5,45.72 63.5,48.26 62.23,49.53 62.23,57.15 58.42,58.42 55.88,58.42 53.34,54.61 8.89,54.61 U$2.U2
VCC  (via drill 0.81)
  Top 0.813: E4.14 44.45,15.24 v46.99,13.97 | C3.1 130.81,12.7 | D11.C 130.81,12.7 | 130.81,12.7 129.54,13.97 129.54,16.51 130.81,17.78 | D9.C 130.81,17.78 | 130.81,17.78 129.54,19.05 129.54,21.59 | 129.54,21.59 130.81,22.86 | D7.C 130.81,22.86 | 130.81,22.86 129.54,24.13 | 129.54,24.13 129.54,26.67 | 129.54,26.67 130.81,27.94 D5.C 132.08,29.21 134.62,30.48 143.51,30.48 144.78,29.21 144.78,26.67 | 144.78,26.67 144.78,24.13 | 144.78,24.13 144.78,21.59 | 144.78,21.59 144.78,19.05 | 144.78,19.05 144.78,16.51 | 144.78,16.51 144.78,13.97 D19.C | D17.C 146.05,17.78 | 146.05,17.78 144.78,16.51 | 146.05,17.78 144.78,19.05 | D15.C 146.05,22.86 | 146.05,22.86 144.78,21.59 | 146.05,22.86 144.78,24.13 | 144.78,26.67 D13.C 149.86,30.48 161.29,30.48 162.56,29.21 162.56,26.67 | 162.56,26.67 162.56,24.13 | 162.56,24.13 162.56,21.59 | 162.56,21.59 162.56,19.05 | 162.56,19.05 162.56,16.51 | 162.56,16.51 162.56,13.97 163.83,12.7 D27.C | D25.C 163.83,17.78 | 163.83,17.78 162.56,16.51 | D23.C 163.83,22.86 | 163.83,22.86 162.56,21.59 | D21.C 162.56,26.67 | 163.83,22.86 162.56,24.13 | 163.83,17.78 162.56,19.05 | D35.C 179.71,13.97 179.71,16.51 D33.C 179.71,19.05 179.71,21.59 D31.C 179.71,24.13 179.71,26.67 D29.C 184.15,30.48 194.31,30.48 199.39,25.4 199.39,10.16 194.31,3.81 121.92,3.81 120.65,5.08 | E3.14 120.65,5.08 | 120.65,5.08 119.38,3.81 102.87,3.81 99.06,11.43 C2.1 E2.14 | v95.25,25.4 100.33,33.02 100.33,35.56 v99.06,36.83 | v83.82,38.1 83.82,43.18 80.01,46.99 D2.C | E5.8 46.99,21.59 C4.1 41.28,24.13 E7.14 | C9.1 129.54,46.99 129.54,35.56 | 129.54,35.56 129.54,26.67 | C8.1 129.54,35.56 | E1.14 C1.1 | 129.54,21.59 C6.1 129.54,24.13
  Bottom 0.813: C11.+ 39.37,13.97 E4.14 | E1.14 64.77,3.81 | 64.77,3.81 63.5,2.54 | 63.5,2.54 45.72,2.54 44.45,3.81 | 44.45,3.81 43.18,5.08 | 43.18,5.08 C11.+ | E2.14 87.63,2.54 66.04,2.54 | 66.04,2.54 64.77,3.81 | 66.04,2.54 64.77,2.54 | 63.5,2.54 64.77,2.54 | 64.77,2.54 64.77,3.81 | C11.+ 40.64,5.08 | 40.64,5.08 39.37,3.81 | 39.37,3.81 40.64,3.81 | 44.45,3.81 43.18,3.81 | 43.18,3.81 41.91,5.08 | 41.91,5.08 41.91,3.81 | 41.91,3.81 40.64,3.81 | 40.64,3.81 41.91,5.08 | 41.91,5.08 C11.+ | C11.+ 40.64,3.81 | 43.18,3.81 C11.+ | 40.64,5.08 44.45,3.81 | 43.18,3.81 41.91,3.81 | 39.37,3.81 43.18,5.08 | v46.99,13.97 E5.8 | C5.1 67.31,25.4 46.99,25.4 | 46.99,25.4 45.72,24.13 | 45.72,24.13 C4.1 44.45,24.13 | 44.45,24.13 44.45,25.4 | 44.45,25.4 44.45,26.67 | 44.45,26.67 C7.1 45.72,26.67 | 46.99,25.4 44.45,25.4 | 46.99,25.4 44.45,26.67 | 46.99,25.4 45.72,26.67 | 46.99,25.4 44.45,24.13 | 45.72,24.13 44.45,25.4 | 44.45,25.4 45.72,26.67 | U$2.A2 8.89,3.81 17.78,3.81 19.05,2.54 38.1,2.54 39.37,3.81 | E9.14 C9.1 | E8.14 C8.1 | E3.14 C3.1 | C2.1 99.06,15.24 101.6,16.51 101.6,20.32 95.25,22.86 v95.25,25.4 | D2.C R1.2 D4.C | v83.82,38.1 97.79,38.1 v99.06,36.83 | E6.14 C6.1
  pour Top (no thermals): 77.47,46.35 80.01,46.35 83.82,42.55 83.82,38.1 84.46,37.47 85.09,38.1 85.09,46.99 83.82,48.26 77.47,48.26 76.84,47.62 76.84,46.99
  pour Bottom (no thermals): 68.58,45.09 67.95,46.35 77.47,56.52 78.74,55.88 74.3,50.16 75.57,48.26 78.11,48.26 79.38,46.99 78.74,46.35 77.47,46.35
  pour Top (no thermals): 64.14,8.26 64.77,6.99 70.49,9.53 69.85,10.79
  pour Bottom (no thermals): 120.65,7.62 125.73,7.62 126.37,7.62 126.37,9.53 120.02,9.53 120.02,7.62
  pour Bottom (no thermals): 120.02,20.95 126.37,20.95 126.37,22.86 120.02,22.86
  pour Top (no thermals): 125.73,7.62 124.46,8.89 128.27,11.43 128.27,20.95 125.73,22.86 128.27,24.13 128.27,33.66 125.73,35.56 128.27,37.47 128.27,46.99 125.73,49.53 129.54,48.9 129.54,34.29 134.62,31.75 194.95,31.75 199.39,29.21 199.39,8.89 194.31,2.54 102.24,2.54 100.33,6.35 97.79,7.62 90.17,7.62 99.06,12.7 102.87,3.81 119.38,3.81 120.65,5.08 121.92,3.81 193.04,3.81 198.76,11.43 198.12,25.4 193.68,30.48 184.15,30.48 180.34,26.67 180.34,23.5 181.61,22.86 180.34,21.59 180.34,18.41 181.61,17.78 180.34,16.51 180.34,14.61 181.61,12.7 179.07,13.34 179.07,27.3 177.17,30.48 168.28,30.48 163.2,26.67 163.2,23.5 163.83,22.86 163.2,22.23 163.2,18.41 163.83,17.78 163.2,17.14 163.2,13.97 165.1,12.7 164.47,12.06 161.93,13.97 161.93,29.21 160.66,30.48 149.86,30.48 145.42,26.67 145.42,23.5 146.05,22.86 145.42,22.23 145.42,18.41 146.05,17.78 145.42,17.14 145.42,13.97 147.96,12.7 147.32,12.06 144.78,13.34 144.78,29.21 143.51,30.48 134.62,30.48 132.08,29.21 129.54,26.67 129.54,24.13 130.81,22.86 129.54,21.59 129.54,19.05 130.81,17.78 129.54,16.51 129.54,13.97 130.81,12.7
  pour Top (no thermals): 120.02,8.89 121.29,8.89 121.29,4.45 120.02,4.45
  pour Bottom (no thermals): 120.02,36.2 120.02,34.29 126.37,34.29 126.37,36.2
  pour Bottom (no thermals): 120.02,49.53 120.02,47.62 126.37,47.62 126.37,49.53
VV
  Top 0.406: D9.A D10.C
  Bottom 0.406: J1.VV 134.62,29.21 134.62,16.51 D10.C 130.81,15.24 129.54,16.51 128.27,19.05 116.84,19.05 E6.12
X
  Bottom 0.406: 83.82,45.72 D1.C 67.31,44.45 66.04,45.72 66.04,48.26 72.39,54.61 72.39,57.15 67.31,59.69 54.61,59.69 52.07,57.15 17.78,57.15 15.24,58.42 8.89,58.42 U$2.V2 | 83.82,45.72 D2.A | 83.82,45.72 83.82,50.8 87.63,53.34 88.9,53.34 95.25,58.42 127,58.42 132.08,53.98 198.12,53.98 203.2,38.1 203.2,10.16 198.12,2.54 170.18,2.54 162.56,6.35 162.56,30.48 J1.X
Z
  Top 0.406: D4.A 86.36,58.42 8.89,58.42 U$2.V1
  Bottom 0.406: D3.C D4.A 92.71,59.69 127,59.69 131.45,56.52 199.39,56.52 204.47,40.64 204.47,10.16 199.39,1.27 170.18,1.27 161.29,5.08 J1.Z

### Text on the board
Bottom: INPUT INTERFACE MODULE | M1501B | SIDE 2 | +